# Altium schematic sheet lab2_samarin_boost.SchDoc: =title_line_1 + title_line_2
size 594 x 420 mm; SheetNumber: n
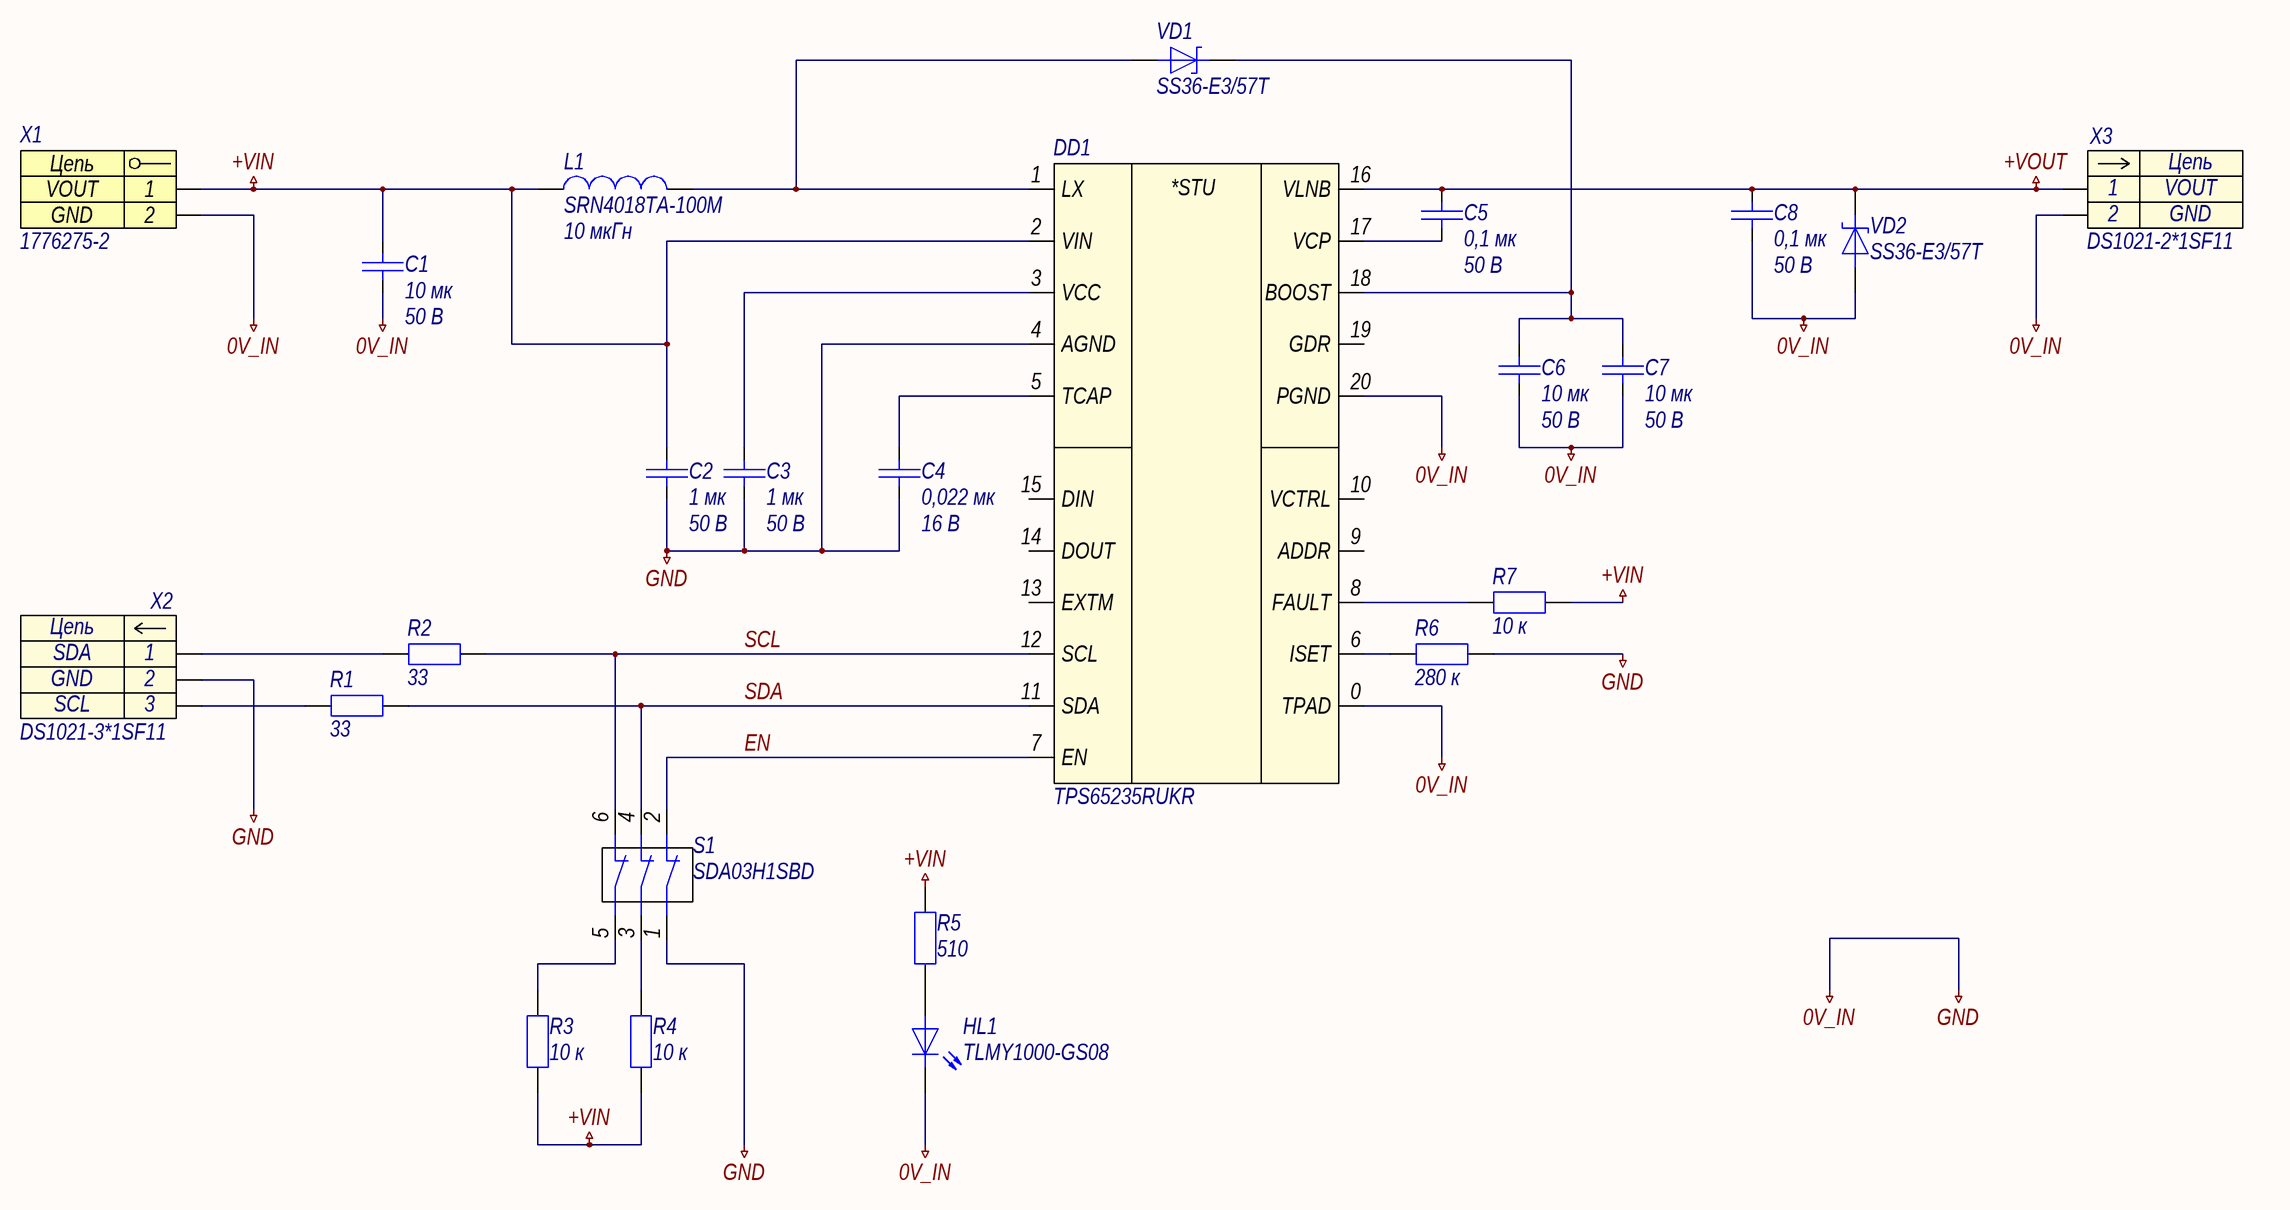
[diagram p0: lab2_samarin_boost.SchDoc]

## Parts
C1  10 мк  Напряжение: 50 В  [C1206]
C2  1 мк  Напряжение: 50 В  [C0603]
C3  1 мк  Напряжение: 50 В  [C0603]
C4  0,022 мк  Напряжение: 16 В  [C0201]
C5  0,1 мк  Напряжение: 50 В  [C0603]
C6  10 мк  Напряжение: 50 В  [C1206]
C7  10 мк  Напряжение: 50 В  [C1206]
C8  0,1 мк  Напряжение: 50 В  [C0603]
DD1  TPS65235RUKR  [QFN-20]
HL1  TLMY1000-GS08  [HL0603]
L1  SRN4018TA-100M  Индуктивность: 10 мкГн  [SRN-2-400X400X180]
R1  33  [R0603]
R2  33  [R0603]
R3  10 к  [R0603]
R4  10 к  [R0603]
R5  510  [R0603]
R6  280 к  [R0603]
R7  10 к  [R0603]
S1  SDA03H1SBD  [DIP-SWITCH-03]
VD1  SS36-E3/57T  [DO-214AB]
VD2  SS36-E3/57T  [DO-214AB]
X1  1776275-2  [1776275-2]
X2  DS1021-3*1SF11  [pls-2,54-3]
X3  DS1021-2*1SF11  [pls-2,54]

## Nets
0V_IN: C1.2 C2.2 C3.2 C4.2 C6.2 C7.2 C8.2 DD1.0(TPAD) DD1.4(AGND) DD1.20(PGND) HL1.1 R6.2 S1.1 VD2.2 X1.2 X2.2 X3.2  [also labelled GND]
+VIN: C1.1 C2.1 DD1.2(VIN) L1.1 R3.1 R4.1 R5.2 R7.2 X1.1
+VOUT: C5.1 C8.1 DD1.16(VLNB) VD2.1 X3.1
EN: DD1.7(EN) S1.2
SCL: DD1.12(SCL) R2.2 S1.6
SDA: DD1.11(SDA) R1.2 S1.4
NetC3_1: C3.1 DD1.3(VCC)
NetC4_1: C4.1 DD1.5(TCAP)
NetC5_2: C5.2 DD1.17(VCP)
NetC6_1: C6.1 C7.1 DD1.18(BOOST) VD1.1
NetDD1_1: DD1.1(LX) L1.2 VD1.2
NetDD1_6: DD1.6(ISET) R6.1
NetDD1_8: DD1.8(FAULT) R7.1
NetHL1_2: HL1.2 R5.1
NetR1_1: R1.1 X2.3
NetR2_1: R2.1 X2.1
NetR3_2: R3.2 S1.5
NetR4_2: R4.2 S1.3

Not connected (* = marked no-connect by the designer): DD1 9(ADDR) 10(VCTRL) 13(EXTM) 14(DOUT) 15(DIN) 19(GDR)

## Notes on the sheet
- Перв. примен.
- Справ. №
- Подп. и дата
- Инв. № дубл.
- Нормоконтроль:
- Взам. инв. №
- Изм.
- Лист
- № докум.
- Подп.
- Дата
- Лит.
- Масса
- Масштаб
- Т.контр.
- Пров.
- Разраб.
- Листов
- Разработал:
- Инв. № подл.
- Н.контр.
- Утв.
- Копировал
- Формат
- А2
- (in symbol dd0005) *STU
- (in symbol HEADER-2_PLG) Цепь
- (in symbol HEADER-3_PLG) Цепь
- (in symbol x0005) Цепь

## Library data of the parts
C1 C6 C7 = c0094: =Описание; ID: c0094; Фамилия: Самарин; Описание: Конденсатор чип 1206 10 мкФ 50 В ±10 %; Наименование: CC1206KKX5R9BB106; Производитель: YAGEO Corp.; Отклонение: ±10 %; Рабочие температуры: от –55 °С до +85 °С; Температурный коэффициент емкости: X5R; Корпус: 1206; Номинал: 10 мк; Номинальное напряжение: 50 В; HelpURL: https://www.yageo.com/upload/media/product/productsearch/datasheet/mlcc/UPY-GPHC_X5R_4V-to-50V_26.pdf
C2 C3 = c0023: =Описание; ID: c0023; Фамилия: Самарин; Описание: Конденсатор чип 0603 1 мкФ 50 В ±10 %; Наименование: CC0603KPX5R9BB105; Производитель: YAGEO Corp.; Отклонение: ±10 %; Рабочие температуры: от -55 °С до +125 °С; Корпус: 0603; Номинал: 1 мк; Номинальное напряжение: 50 В; HelpURL: https://www.yageo.com/upload/media/product/productsearch/datasheet/mlcc/UPY-GPHC_X5R_4V-to-50V_26.pdf
C4 = c0015: =Описание; ID: c0015; Фамилия: Жернаков; Описание: Конденсатор чип 0201 0,022 мкФ 16 В ±10 %; Наименование: CC0201KRX5R7BB223; Производитель: YAGEO Corp.; Отклонение: ±10 %; Рабочие температуры: от -55 °С до +85 °С; Корпус: 0201; Номинал: 0,022 мк; Номинальное напряжение: 16 В; HelpURL: https://www.yageo.com/upload/media/product/productsearch/datasheet/mlcc/UPY-GPHC_X5R_4V-to-50V_26.pdf
C5 C8 = c0018: =Описание; ID: c0018; Фамилия: Ларионов; Описание: Конденсатор чип 0603 0,1 мкФ 50 В ±5 %; Наименование: CC0603JRX7R9BB104; Производитель: YAGEO Corp.; Отклонение: ±5 %; Рабочие температуры: от -55 °С до +125 °С; Корпус: 0603; Номинал: 0,1 мк; Номинальное напряжение: 50 В; HelpURL: https://www.yageo.com/upload/media/product/products/datasheet/mlcc/UPY-GPHC_X7R_6.3V-to-50V_20.pdf
DD1 = dd0005: =Описание; ID: dd0005; Фамилия: Самарин; Описание: Повышающий преобразователь напряжения 20 В и 3 А; Производитель: Texas Instruments; Входное напряжение: от 4,5 В до 20 В; Выходное напряжение: от 11 В до 20 В; Коммутируемый ток: до 1 А; Частота переключения: до 1 МГц; Рабочие температуры: от -40 °С до +85 °С; Наименование: TPS65235RUKR; Корпус: QFN-20; HelpURL: https://www.ti.com/product/TPS65235
HL1 = hl0003: =Описание; ID: hl0003; Фамилия: Ларионов; Описание: Светодиод чип 0603 желтый; Производитель: Vishay Intertechnology, Inc.; Цвет: Yellow; Номинальная сила света: 7,5 мкд; Номинальная длина волны: 588 нм; Номинальный прямой ток: 15 мА; Номинальное падение напряжения: 1,8 В; Рассеиваемая мощность: 40 мВт; Рабочие температуры: от -40 °С до +100 °С; Корпус: 0603; Наименование: TLMY1000-GS08; HelpURL: https://www.vishay.com/leds/list/product-83172/
L1 = l0003: =Описание; ID: l0003; Фамилия: Самарин; Описание: Катушка индуктивности 10 мкГн ±20 %; Производитель: Bourns, Inc.; Отклонение: ±20 %; Номинальное активное сопротивление: 150 мОм; Максимальное активное сопротивление: не указано; Резонансная частота: 35 МГц; Номинальный ток (при нагреве на 20 °С/40 °С): 1,5 А; Рабочие температуры: от –55 °С до +125 °С; Корпус: 4,0 x 4,0 x 1,8; Наименование: SRN4018TA-100M; Номинал: 10 мкГн; Ток насыщения: 1,5 А; Рабочее напряжение: не указано; HelpURL: https://www.bourns.com/products/magnetic-products/power-inductors-aec-q200-compliant/product/SRN4018TA
R1 R2 = r0005: =Описание; ID: r0005; Фамилия: Козлов; Описание: Резистор чип 0603 33 Ом ±1 % 0,1 Вт; Наименование: AA0603FR-0733RL; Производитель: YAGEO Corp.; Отклонение: ±1 %; Номинальное напряжение: 75 В; Рабочие температуры: от -55 °С до +155 °С; Номинальный ток: 1 А; Корпус: 0603; Номинал: 33; HelpURL: https://www.yageo.com/upload/media/product/productsearch/datasheet/rchip/PYu-AA_51_RoHS_L_3.pdf
R3 R4 R7 = r0022: =Описание; ID: r0022; Фамилия: Самарин; Описание: Резистор чип 0603 10 кОм ±1 % 0,1 Вт; Наименование: RC0603FR-0710KL; Производитель: YAGEO Corp.; Отклонение: ±1 %; Номинальное напряжение: 75 В; Рабочие температуры: от -55 °С до +155 °С; Номинальный ток: 1 А; Корпус: 0603; Номинал: 10 к; HelpURL: https://www.yageo.com/upload/media/product/productsearch/datasheet/rchip/PYu-RC_Group_51_RoHS_L_11.pdf
R5 = r0011: =Описание; ID: r0011; Фамилия: Самарин; Описание: Резистор чип 0603 510 Ом ±1 % 0,1 Вт; Наименование: RC0603FR-07510RL; Производитель: YAGEO Corp.; Отклонение: ±1 %; Номинальное напряжение: 75 В; Рабочие температуры: от -55 °С до +155 °С; Номинальный ток: 1 А; Корпус: 0603; Номинал: 510; HelpURL: https://www.yageo.com/upload/media/product/productsearch/datasheet/rchip/PYu-RC_Group_51_RoHS_L_11.pdf
R6 = r0040: =Описание; ID: r0040; Фамилия: Паньков; Описание: Резистор чип 0603 280 кОм ±1 % 0,1 Вт; Наименование: RC0603FR-07280KL; Производитель: YAGEO Corp.; Отклонение: ±1 %; Номинальное напряжение: 75 В; Рабочие температуры: от -55 °С до +155 °С; Номинальный ток: 1 А; Корпус: 0603; Номинал: 280 к; HelpURL: https://www.yageo.com/upload/media/product/productsearch/datasheet/rchip/PYu-RC_Group_51_RoHS_L_11.pdf
S1 = sw0003: =Описание; ID: sw0003; Фамилия: Самарин; Описание: 3-х позиционный движковый переключатель; Производитель: C&K; Ток нагрузки: 100 мА @ 5 В; Сопротивление контакта: 50 мОм; Количество контактов: 3; Рабочие температуры: от -40 °С до +85 °С; Промывка: Разрешена; Корпус: 7,06х9,30х5,45; Наименование: SDA03H1SBD; HelpURL: https://www.ckswitches.com/products/switches/product-details/DIP/SDA/SDA02H1SBD/
VD1 VD2 = vd0004: =Описание; ID: vd0004; Фамилия: Жернаков; Описание: Диод Шоттки 60 В 3 А; Производитель: Vishay Intertechnology, Inc.; Пиковое прямое напряжение: 0,75 В; Импульсное обратное напряжение: 60 В; Макс допустимый средний прямой ток: 3 А; Рабочие температуры: от –55 °С до +150 °С; Наименование: SS36-E3/57T; Корпус: DO-214AB; HelpURL: https://www.vishay.com/product?docid=88751
X1 = x0005: =Описание; Contact_1: VOUT; Contact_2: GND; ID: x0005; Фамилия: Паньков; Описание: Клеммная колодка 2 pin 3,5 мм; Производитель: TE Connectivity; Наименование: 1776275-2; HelpURL: https://www.te.com/usa-en/product-1776275-2.html
X2 = HEADER-3_PLG: Contact_1: SDA; Contact_2: GND; Contact_3: SCL
X3 = HEADER-2_PLG: Contact_1: VOUT; Contact_2: GND